# EAGLE design opampStone-v1 (EAGLE 7.1.0)
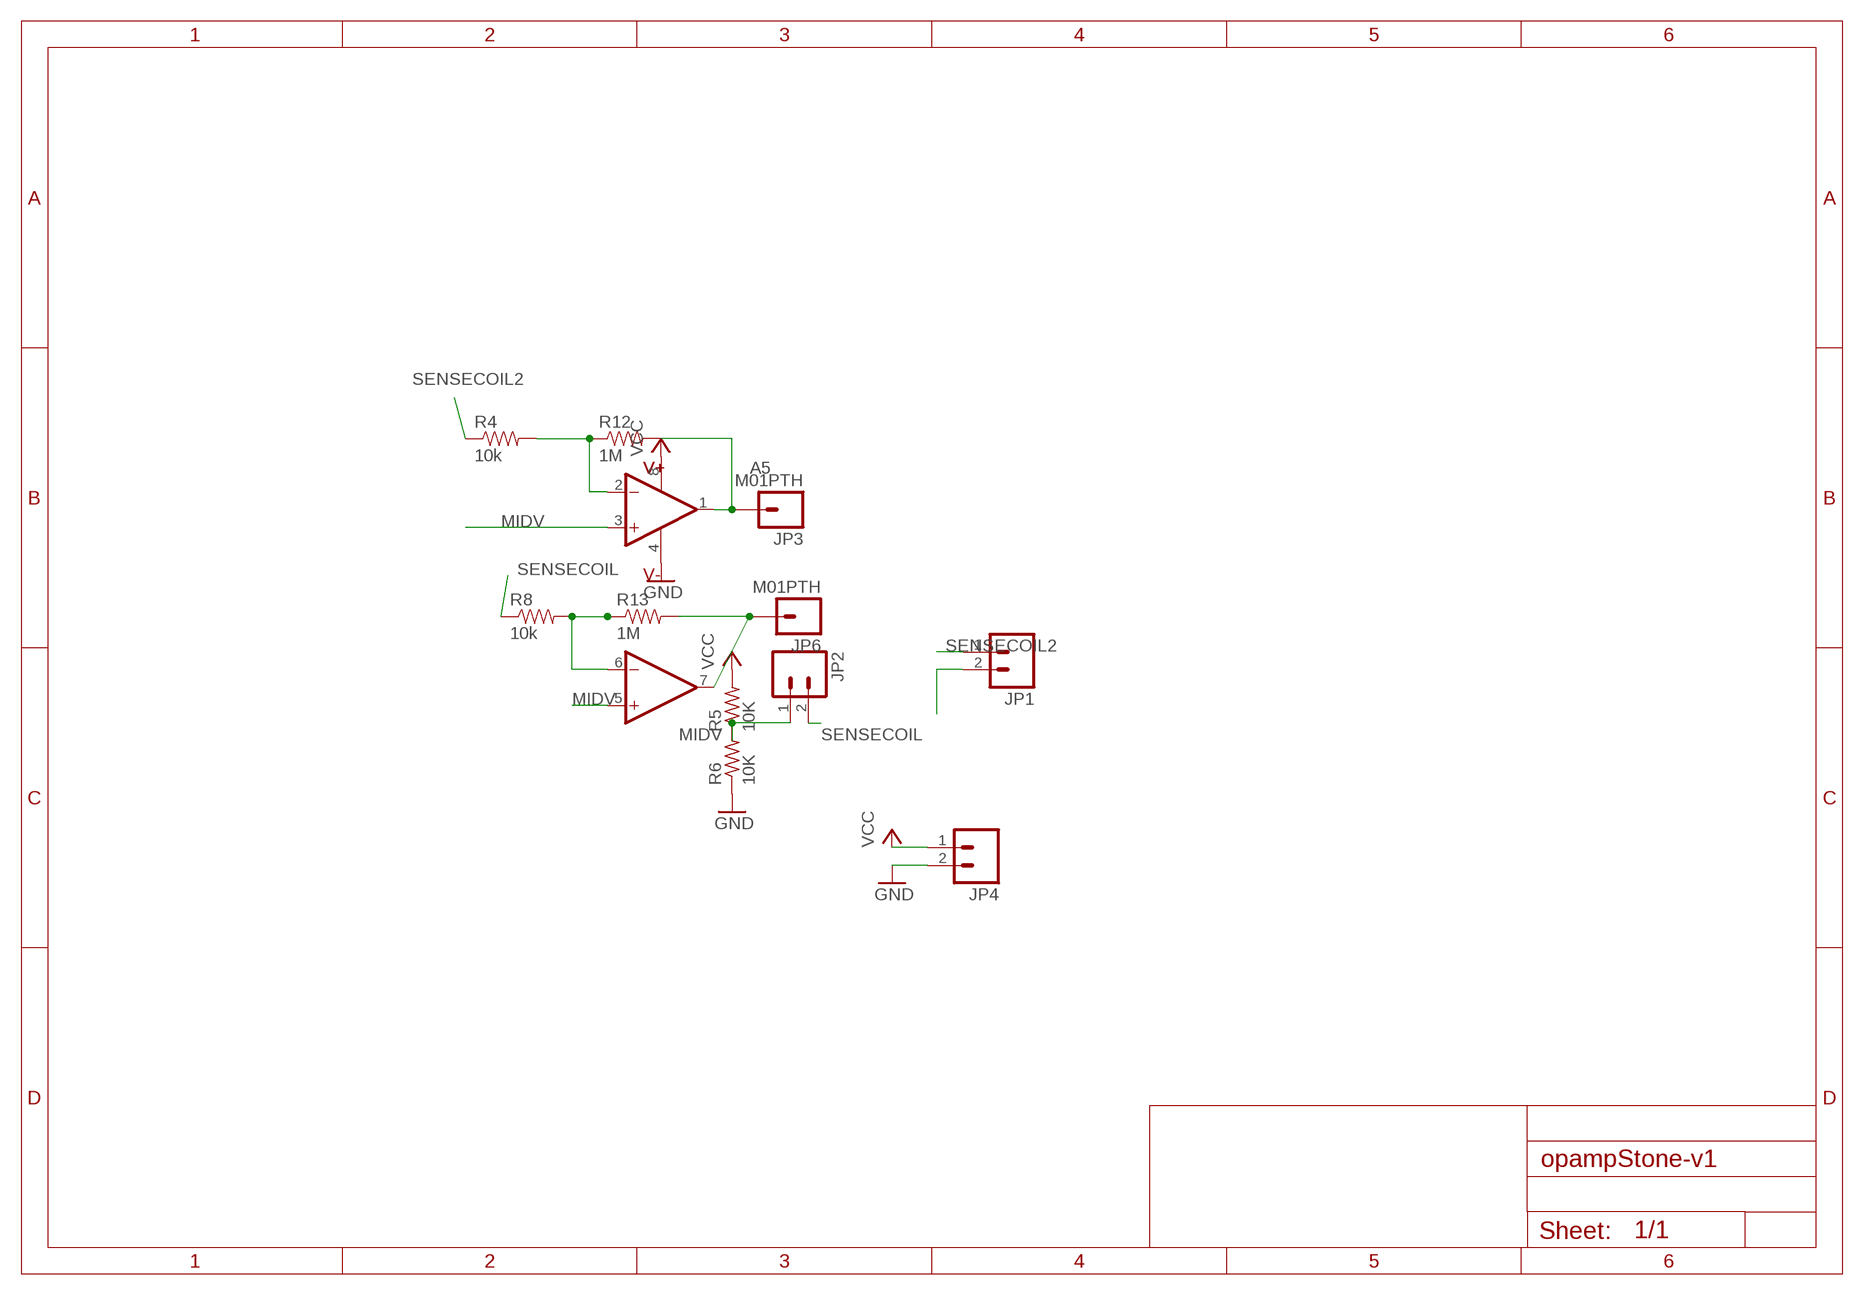
[diagram p0: schematic, sheet 1]

## Parts
JP1  M02PTH  [1X02]
JP2  M02PTH  [1X02]
JP3  M01PTH  [1X01]
JP4  M02PTH  [1X02]
JP6  M01PTH  [1X01]
R4  10k  RESISTOR0603  [0603-RES]
R5  10K  R-US_R0603  [R0603]
R6  10K  R-US_R0603  [R0603]
R8  10k  RESISTOR0603  [0603-RES]
R12  1M  RESISTOR0805-RES  [0805]
R13  1M  RESISTOR0805-RES  [0805]
U2  MCP6242  [8-SOIC]

## Nets
A4: JP6.1 R13.2 U2.7(OUTB)
A5: JP3.1 R12.2 U2.1(OUTA)
GND: JP4.2 R6.1 U2.4(V-)
MIDV: JP1.2 JP2.1 R5.1 R6.2 U2.3(+INA) U2.5(+INB)
N$13: R4.2 R12.1 U2.2(-INA)
N$15: R8.2 R13.1 U2.6(-INB)
SENSECOIL: JP2.2 R8.1
SENSECOIL2: JP1.1 R4.1
VCC: JP4.1 R5.2 U2.8(V+)

## Library data of the parts
JP1 JP2 JP4 = SparkFun-Connectors:M02: Standard 2-pin 0.1" header. Use with - straight break away headers ( PRT-00116) - right angle break away headers (PRT-00553) - swiss pins (PRT-00743) - machine pins (PRT-00117) - female headers (PRT-00115) Molex polarized connector foot print use with: PRT-08233 with associated crimp pins and housings. 2.54_SCREWTERM for use with PRT-10571. 3.5mm Screw Terminal footprints for PRT-08084 5mm Screw Terminal footprints for use with PRT-08432
JP3 JP6 = SparkFun-Connectors:M01: Header 1 Standard 1-pin 0.1" header. Use with straight break away headers (SKU : PRT-00116), right angle break away headers (PRT-00553), swiss pins (PRT-00743), machine pins (PRT-00117), and female headers (PRT-00115).
R4 R8 = SparkFun-Resistors:RESISTOR: Resistor Basic schematic elements and footprints for 0603, 1206, and PTH resistors.
R5 R6 = resistor:R-US_: RESISTOR, American symbol
R12 R13 = SparkFun-Passives:RESISTOR: Resistor Basic schematic elements and footprints for 0603, 1206, and PTH resistors.
U2 = spietz-library:MCP6242

## Net classes
0 default: width 0.203 mm
1 vcc: width 0.254 mm

## Board
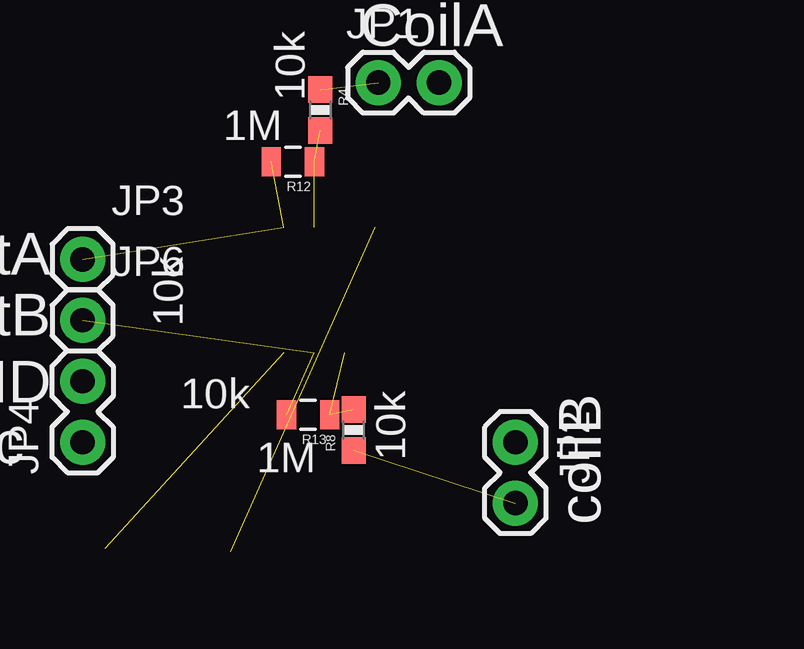
[diagram p1: board, top side]
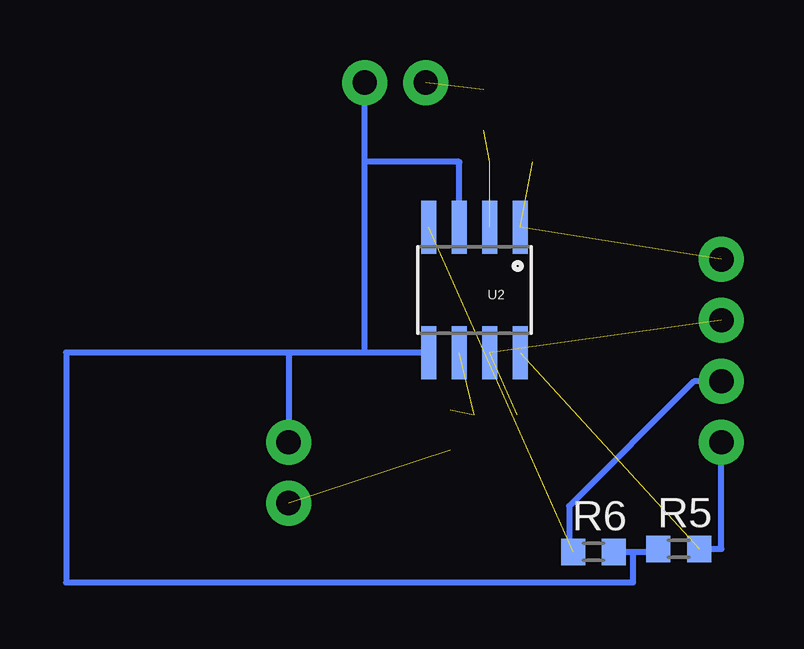
[diagram p2: board, bottom side, seen from below]

No outline drawn. Coordinates in mm, seen from the top.
Copper layers (1*16): Top 0.035mm / dielectric 1.5mm / Bottom 0.035mm
Design rules "default": minimum track width 10mil, minimum drill 24mil, track to track 8mil, track to pad 8mil, pad to pad 8mil, via to via 8mil, smd to smd 8mil, copper to edge 40mil, drill to drill 8mil, minimum pad ring 10mil, minimum via ring 8mil, stop-mask expansion 4mil, vias tented up to drill 0mil, thermal gap 10mil

### Footprints (pad centres in the part's own frame; a part is rotated, then mirrored left to right if it is on the bottom)
1X02 = drill 1.016 pad 1.88: 1 0,0; 2 2.54,0
1X01 = drill 1.016 pad 1.88: 1 0,0
0603-RES = smd 1.1 x 1: 1 -0.85,0; 2 0.85,0
R0603 = smd 1 x 1.1: 1 -0.85,0; 2 0.85,0
0805 = smd 0.8 x 1.2: 1 -0.9,0; 2 0.9,0
8-SOIC = smd 0.61 x 2.21: 1 -1.905,-2.616; 2 -0.635,-2.616; 3 0.635,-2.616; 4 1.905,-2.616; 5 1.905,2.616; 6 0.635,2.616; 7 -0.635,2.616; 8 -1.905,2.616

### Placement (x,y rotation side)
JP1  26.54,20.57 0 top
JP2  32.26,5.59 270 top
JP3  14.22,13.21 0 top
JP4  14.22,5.59 90 top
JP6  14.22,10.67 0 top
R4  24.13,19.43 270 top
R5  16,1.14 0 bottom
R6  19.56,1.02 0 bottom
R8  25.53,6.1 90 top
R12  22.99,17.27 180 top
R13  23.62,6.73 180 top
U2  24.51,11.94 180 bottom

### Tracks (layer width: path | path; a pad name or v marks a point on that pad's centre or on a via)
A4  (2 unrouted)
A5  (2 unrouted)
GND  (1 unrouted)
  Bottom 0.254: JP4.2 15.37,8.13 20.57,2.92 20.57,1.18 R6.1
MIDV
  Bottom 0.254: 29.08,9.32 U2.5 41.53,9.32 41.53,-0.25 17.91,-0.25 17.91,1.02 | 29.08,9.32 29.08,17.27 | 29.08,17.27 JP1.2 | 29.08,9.32 32.26,9.32 JP2.1 | U2.3 25.15,17.27 29.08,17.27 | R6.2 17.91,1.02 | 17.91,1.02 16.85,1.02 R5.1
N$13  (2 unrouted)
N$15  (2 unrouted)
SENSECOIL  (1 unrouted)
SENSECOIL2  (1 unrouted)
VCC  (1 unrouted)
  Bottom 0.254: R5.2 14.22,1.14 JP4.1

### Text on the board
tPlace: CoilA | 10k | 1M | outA | outB | 10k | 10k | GND | Vcc | 10k | 1M | coilB